# EAGLE design Probe.Board (EAGLE 6.6.0)
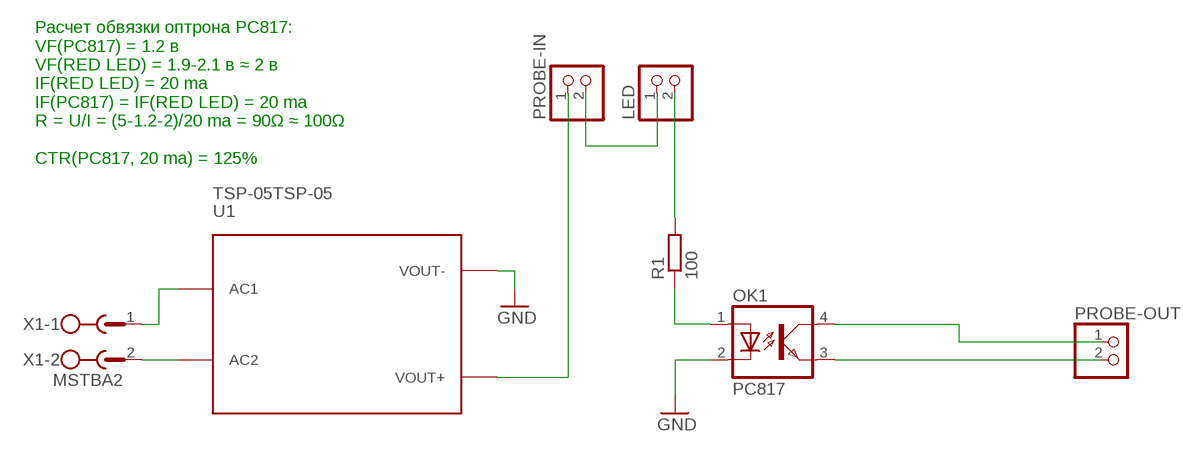
[diagram p0: schematic, sheet 1]

## Parts
LED  PINHD-1X2/90  [1X02/90]
OK1  PC817  [DIL04]
PROBE-IN  PINHD-1X2/90  [1X02/90]
PROBE-OUT  PINHD-1X2/90  [1X02/90]
R1  100  R-EU_0207/12  [0207/12]
U1  TSP-05TSP-05  [TSP-05]
X1  MSTBA2  [MSTBA2]

## Nets
GND: OK1.2(C) U1.P$3(VOUT-)
N$1: U1.P$2(AC2) X1.2
N$2: U1.P$1(AC1) X1.1
N$3: OK1.3(EMIT) PROBE-OUT.2
N$4: OK1.4(COL) PROBE-OUT.1
N$5: OK1.1(A) R1.1
N$6: LED.2 R1.2
N$7: LED.1 PROBE-IN.2
N$8: PROBE-IN.1 U1.P$4(VOUT+)

## Notes on the sheet
- Расчет обвязки оптрона PC817:
  VF(PC817) = 1.2 в
  VF(RED LED) = 1.9-2.1 в ≈ 2 в
  IF(RED LED) = 20 ma
  IF(PC817) = IF(RED LED) = 20 ma
  R = U/I = (5-1.2-2)/20 ma = 90Ω ≈ 100Ω
  
  CTR(PC817, 20 ma) = 125%

## Library data of the parts
LED PROBE-IN PROBE-OUT = pinhead:PINHD-1X2: PIN HEADER
OK1 = optocoupler:PC817: SHARP OPTO COUPLER; MPN: PC817X4J000F; OC_FARNELL: 9707727; OC_NEWARK: 97K7059
R1 = rcl:R-EU_: RESISTOR, European symbol
U1 = net173:TSP-05
X1 = con-phoenix-508:MSTBA2: PHOENIX

## Board
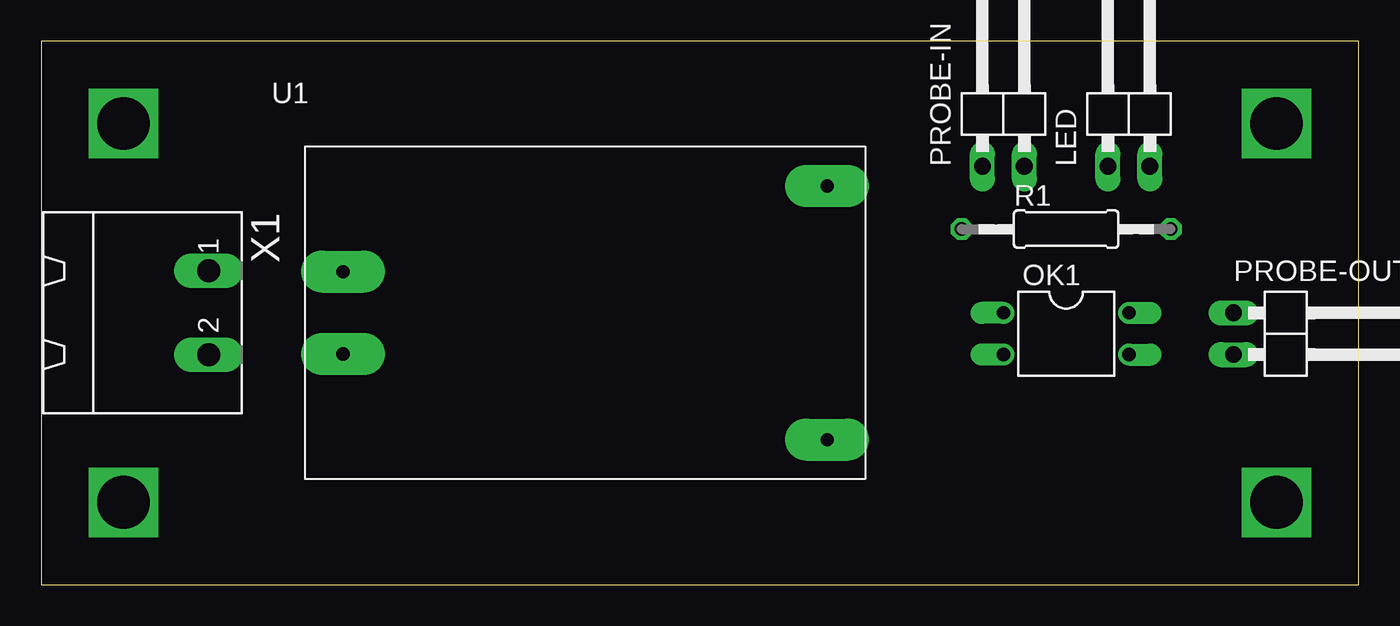
[diagram p1: board, top side]
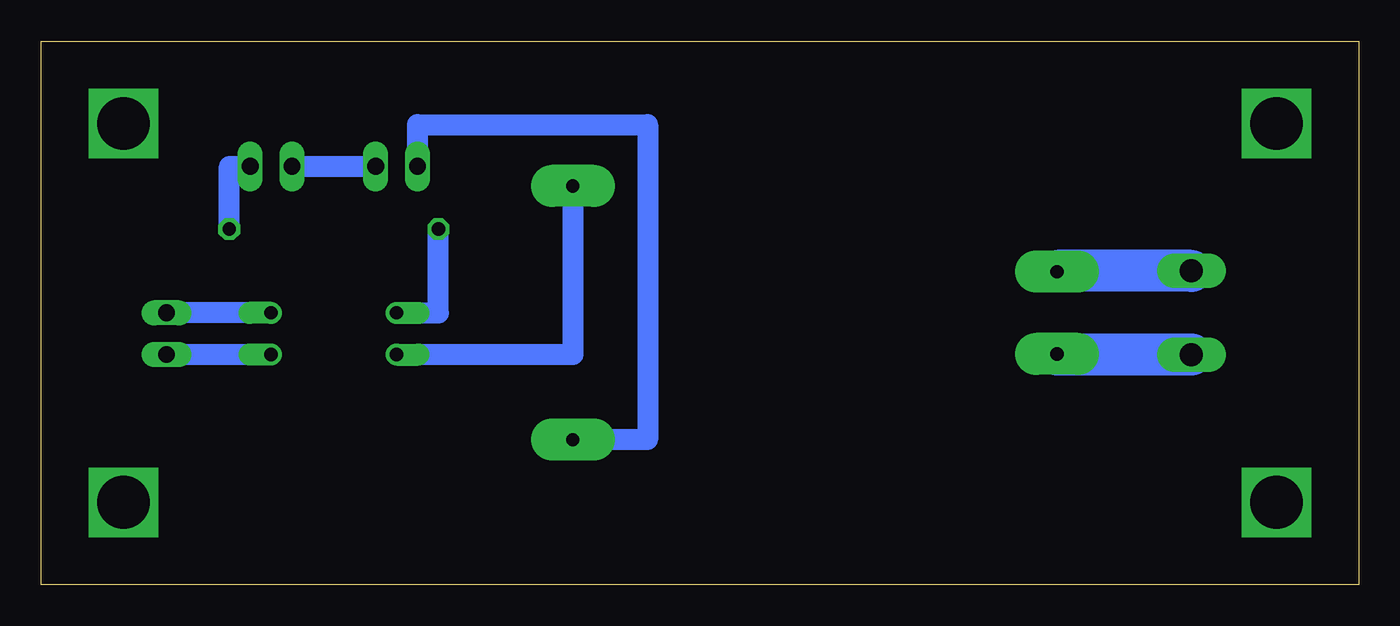
[diagram p2: board, bottom side, seen from below]

Size 80 x 33 mm. Coordinates in mm from the lower left corner, seen from the top.
Outline: 0,0 80,0 80,33 0,33 0,0
Copper layers (1*16): Top 0.035mm / dielectric 1.5mm / Bottom 0.035mm
Design rules "default": minimum track width 10mil, minimum drill 24mil, track to track 8mil, track to pad 8mil, pad to pad 8mil, via to via 8mil, smd to smd 8mil, copper to edge 40mil, drill to drill 8mil, minimum pad ring 10mil, minimum via ring 8mil, stop-mask expansion 4mil, vias tented up to drill 0mil, thermal gap 10mil

### Footprints (pad centres in the part's own frame; a part is rotated, then mirrored left to right if it is on the bottom)
1X02/90 = drill 1.016 long: 1 -1.27,-3.81; 2 1.27,-3.81
DIL04 = drill 0.813 offset: 1 -1.27,-3.81; 2 1.27,-3.81; 3 1.27,3.81; 4 -1.27,3.81
0207/12 = drill 0.813 octagon: 1 -6.35,0; 2 6.35,0
TSP-05 = drill 0.8 pad 2.54 long: P$1 -14.7,2.5; P$2 -14.7,-2.5; P$3 14.7,7.7; P$4 14.7,-7.7
MSTBA2 = drill 1.397 long: 1 -2.54,5.08; 2 2.54,5.08

### Placement (x,y rotation side)
LED  66.04,29.21 0 top
OK1  62.23,15.24 270 top
PROBE-IN  58.42,29.21 0 top
PROBE-OUT  76.2,15.24 270 top
R1  62.23,21.59 0 top
U1  33.02,16.51 0 top
X1  5.08,16.51 270 top

### Tracks (layer width: path | path; a pad name or v marks a point on that pad's centre or on a via)
GND
  Bottom 1.27: U1.P$3 47.72,13.97 OK1.2
N$1
  Bottom 2.54: X1.2 18.32,13.97 U1.P$2
N$2
  Bottom 2.54: X1.1 18.32,19.05 U1.P$1
N$3
  Bottom 1.27: OK1.3 PROBE-OUT.2
N$4
  Bottom 1.27: OK1.4 PROBE-OUT.1
N$5
  Bottom 1.27: OK1.1 55.88,16.51 R1.1
N$6
  Bottom 1.27: R1.2 68.58,25.4 LED.2
N$7
  Bottom 1.27: LED.1 PROBE-IN.2
N$8
  Bottom 1.27: PROBE-IN.1 57.15,27.94 43.18,27.94 43.18,8.81 U1.P$4
N$9  (via drill 3.2)
  other vias: 5,5
N$10  (via drill 3.2)
  other vias: 5,28
N$11  (via drill 3.2)
  other vias: 75,28
N$12  (via drill 3.2)
  other vias: 75,5